# EAGLE design IDC-AMPSEAL (EAGLE 9.1.3)
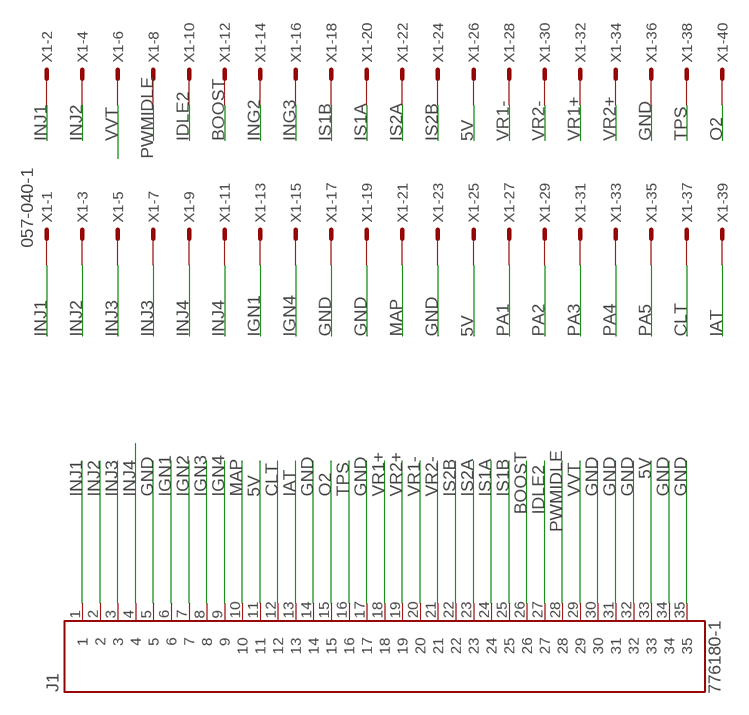
[diagram p0: schematic, sheet 1]

## Parts
J1  776180-1  [TE_776180-1]
X1  057-040-1  [057-040-1]

## Nets
5V: J1.11 J1.33 X1.25 X1.26
BOOST: J1.26 X1.12
CLT: J1.12 X1.37
GND: J1.5 J1.14 J1.17 J1.30 J1.31 J1.32 J1.34 J1.35 X1.17 X1.19 X1.23 X1.36
IAT: J1.13 X1.39
IDLE2: J1.27 X1.10
IGN1: J1.6 X1.13
IGN2: J1.7
IGN3: J1.8
IGN4: J1.9 X1.15
ING2: X1.14
ING3: X1.16
INJ1: J1.1 X1.1 X1.2
INJ2: J1.2 X1.3 X1.4
INJ3: J1.3 X1.5 X1.7
INJ4: J1.4 X1.9 X1.11
IS1A: J1.24 X1.20
IS1B: J1.25 X1.18
IS2A: J1.23 X1.22
IS2B: J1.22 X1.24
MAP: J1.10 X1.21
O2: J1.15 X1.40
PA1: X1.27
PA2: X1.29
PA3: X1.31
PA4: X1.33
PA5: X1.35
PWMIDLE: J1.28 X1.8
TPS: J1.16 X1.38
VR1+: J1.18 X1.32
VR1-: J1.20 X1.28
VR2+: J1.19 X1.34
VR2-: J1.21 X1.30
VVT: J1.29 X1.6

## Library data of the parts
J1 = 776180-1:776180-1: Conn Rectangular HDR 35 POS Solder RA Thru-Hole Automotive; MANUFACTURER: TE CONNECTIVITY; PARTREV: H7; STANDARD: STANDARED RECOMENDATION
X1 = con-panduit:057-040-: CONNECTOR 40-pin series 057 contact pc board low profile headers; OC_FARNELL: unknown; OC_NEWARK: unknown

## Board
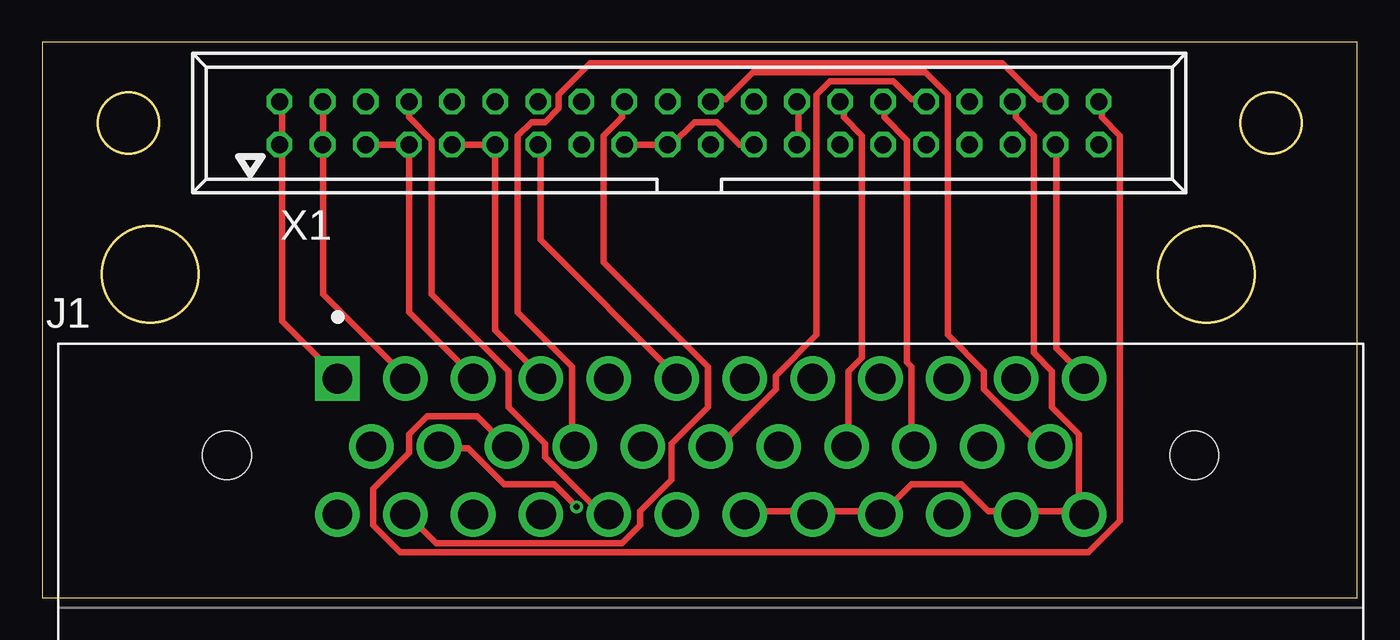
[diagram p1: board, top side]
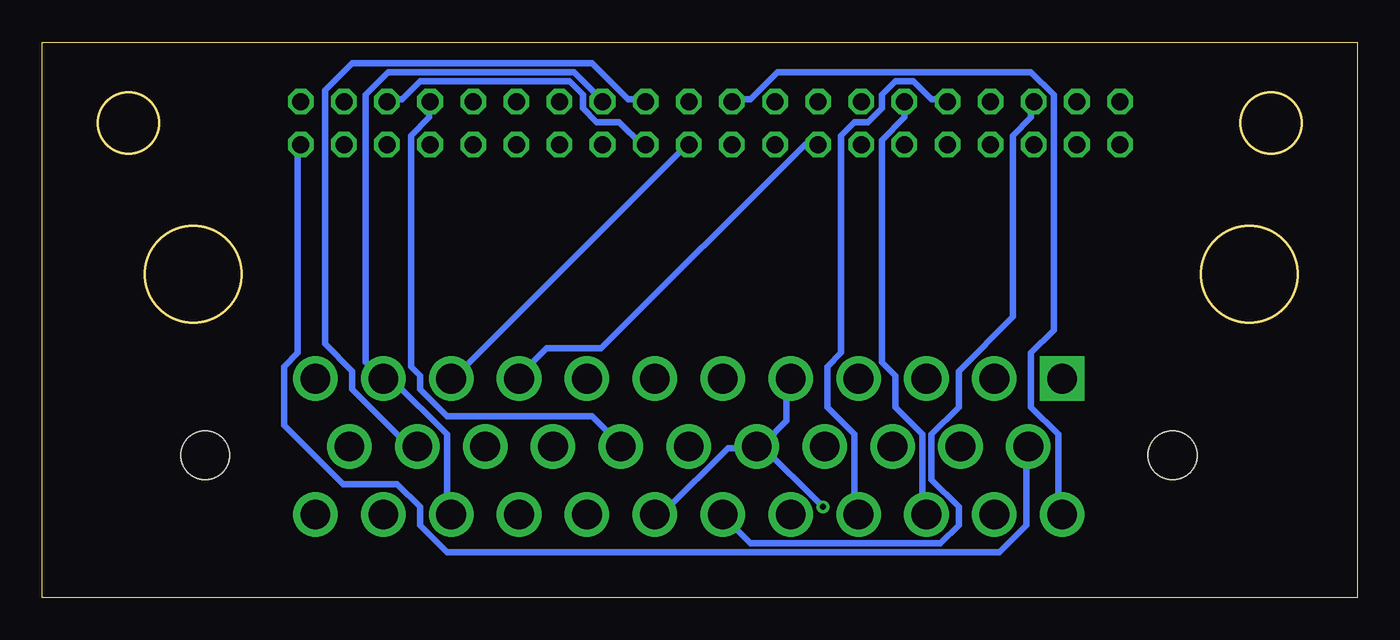
[diagram p2: board, bottom side, seen from below]

Size 77.45 x 32.69 mm. Coordinates in mm from the lower left corner, seen from the top.
Outline: 0,0 77.45,0 77.45,32.69 0,32.69 0,0
Outline: circle at 6.35,19.05 radius 2.84
Outline: circle at 68.58,19.05 radius 2.84
Outline: circle at 72.39,27.94 radius 1.8
Outline: circle at 5.08,27.94 radius 1.8
Copper layers (1*16): Top 0.035mm / dielectric 1.5mm / Bottom 0.035mm
Design rules "default *": minimum track width 15mil, minimum drill 0.35mm, track to track 6mil, track to pad 6mil, pad to pad 6mil, via to via 6mil, smd to smd 6mil, copper to edge 40mil, drill to drill 6mil, minimum pad ring 10mil, minimum via ring 8mil, stop-mask expansion 4mil, vias tented up to drill 0mil, thermal gap 10mil

### Footprints (pad centres in the part's own frame; a part is rotated, then mirrored left to right if it is on the bottom)
TE_776180-1 = drill 1.75 square: 1 -22,4 | drill 1.75: 2 -18,4; 3 -14,4; 4 -10,4; 5 -6,4; 6 -2,4; 7 2,4; 8 6,4; 9 10,4; 10 14,4; 11 18,4; 12 22,4; 13 -20,0; 14 -16,0; 15 -12,0; 16 -8,0; 17 -4,0; 18 0,0; 19 4,0; 20 8,0; 21 12,0; 22 16,0; 23 20,0; 24 -22,-4; 25 -18,-4; 26 -14,-4; 27 -10,-4; 28 -6,-4; 29 -2,-4; 30 2,-4; 31 6,-4; 32 10,-4; 33 14,-4; 34 18,-4; 35 22,-4 | hole 2.85: -28.5,-0.5; 28.5,-0.5
057-040-1 = drill 1 octagon: 1 -24.13,-1.27; 2 -24.13,1.27; 3 -21.59,-1.27; 4 -21.59,1.27; 5 -19.05,-1.27; 6 -19.05,1.27; 7 -16.51,-1.27; 8 -16.51,1.27; 9 -13.97,-1.27; 10 -13.97,1.27; 11 -11.43,-1.27; 12 -11.43,1.27; 13 -8.89,-1.27; 14 -8.89,1.27; 15 -6.35,-1.27; 16 -6.35,1.27; 17 -3.81,-1.27; 18 -3.81,1.27; 19 -1.27,-1.27; 20 -1.27,1.27; 21 1.27,-1.27; 22 1.27,1.27; 23 3.81,-1.27; 24 3.81,1.27; 25 6.35,-1.27; 26 6.35,1.27; 27 8.89,-1.27; 28 8.89,1.27; 29 11.43,-1.27; 30 11.43,1.27; 31 13.97,-1.27; 32 13.97,1.27; 33 16.51,-1.27; 34 16.51,1.27; 35 19.05,-1.27; 36 19.05,1.27; 37 21.59,-1.27; 38 21.59,1.27; 39 24.13,-1.27; 40 24.13,1.27

### Placement (x,y rotation side)
J1  39.37,8.89 0 top
X1  38.1,27.94 0 top

### Tracks (layer width: path | path; a pad name or v marks a point on that pad's centre or on a via)
5V
  Top 0.381: X1.25 44.54,26.67 44.54,29.07 X1.26
  Bottom 0.381: X1.26 44.54,29.34 46.14,30.94 57.07,30.94 58.41,29.6 58.41,13.87 57.61,13.07 J1.11 57.34,12.8 56.81,12.8 53.61,9.6 53.61,5.07 J1.33
BOOST
  Bottom 0.381: X1.12 26.67,28.27 28,26.94 28,13.87 27.2,13.07 27.2,11.2 25.6,9.6 25.6,5.07 J1.26
CLT
  Top 0.381: X1.37 59.74,26.67 59.74,14.67 61.34,13.07 J1.12
GND  (via drill 0.35)
  Top 0.381: X1.17 X1.19 37.07,26.67 38.41,28 39.74,28 41.07,26.67 X1.23 | v31.47,5.33 30.14,6.67 27.2,6.67 25.07,8.8 23.47,8.8 J1.14 | 61.07,5.07 61.34,5.07 J1.35 61.07,5.07 | 61.07,5.07 57.61,5.07 J1.34 57.34,5.07 55.74,5.07 54.14,6.67 51.21,6.67 49.61,5.07 J1.32 49.34,5.07 45.61,5.07 J1.31 45.34,5.07 41.6,5.07 J1.30 | 61.07,5.07 61.07,9.6 59.47,11.2 59.47,13.34 58.41,14.4 58.41,27.2 57.34,28.27 57.34,29.07 X1.36
  Bottom 0.381: X1.36 57.07,29.34 56.27,29.34 55.21,30.4 46.41,30.4 45.61,29.6 45.61,28.8 44.81,28 43.47,28 42.14,26.67 X1.23 | v31.47,5.33 35.2,9.07 J1.17 | J1.5 33.6,12.8 33.6,10.4 34.94,9.07 J1.17 | J1.17 35.47,8.8 37.07,8.8 40.8,5.07 41.34,5.07 J1.30
IAT
  Bottom 0.381: X1.39 62.41,26.67 62.41,14.4 63.21,13.6 63.21,10.13 59.74,6.67 56.54,6.67 55.21,5.33 55.21,4.27 53.61,2.67 21.07,2.67 19.47,4.27 19.47,8.8 J1.13
IDLE2
  Bottom 0.381: X1.10 24.27,29.34 25.07,29.34 26.14,30.4 27.2,30.4 28,29.6 28,28.8 28.8,28 29.6,28 30.4,27.2 30.4,14.4 31.2,13.6 31.2,11.2 29.6,9.6 29.6,5.07 J1.27
IGN1
  Top 0.381: X1.13 29.34,26.67 29.34,21.07 37.34,13.07 J1.6
IGN4
  Bottom 0.381: X1.15 32.54,26.67 44.54,14.67 47.74,14.67 49.34,13.07 J1.9
INJ1
  Top 0.381: 14.13,26.67 14.13,29.07 X1.2 | 14.13,26.67 14.13,16.27 17.34,13.07 J1.1 | 14.13,26.67 X1.1
INJ2
  Top 0.381: 16.54,26.67 16.54,29.07 X1.4 | 16.54,26.67 16.54,17.87 21.34,13.07 J1.2 | 16.54,26.67 X1.3
INJ3
  Top 0.381: X1.5 X1.7 21.6,26.67 21.6,16.8 25.34,13.07 J1.3
INJ4
  Top 0.381: X1.9 X1.11 26.67,15.73 29.34,13.07 J1.4
IS1A
  Bottom 0.381: X1.20 36.8,29.34 35.74,29.34 34.14,30.94 19.2,30.94 17.87,29.6 17.87,15.73 19.2,14.4 19.2,11.2 17.6,9.6 17.6,5.07 J1.24
IS1B
  Top 0.381: X1.18 34.14,29.07 34.14,28.27 33.07,27.2 33.07,19.74 39.2,13.6 39.2,11.2 37.07,9.07 37.07,6.93 35.2,5.07 35.2,4.27 34.14,3.2 23.2,3.2 21.6,4.8 J1.25
IS2A
  Top 0.381: X1.22 39.47,29.34 40.27,29.34 41.87,30.94 52.01,30.94 53.34,29.6 53.34,15.47 55.47,13.34 55.47,12.27 58.67,9.07 59.21,9.07 J1.23
IS2B
  Bottom 0.381: X1.24 42.14,29.34 42.94,29.34 45.07,31.47 59.21,31.47 60.81,29.87 60.81,14.94 59.21,13.34 59.21,12.27 56.01,9.07 55.47,9.07 J1.22
MAP
  Bottom 0.381: X1.21 39.47,26.67 53.34,12.8 J1.10
O2
  Top 0.381: X1.40 62.41,29.07 62.41,28.27 63.48,27.2 63.48,4.53 61.61,2.67 21.07,2.67 19.47,4.27 19.47,6.4 21.6,8.53 21.6,9.6 22.67,10.67 25.6,10.67 27.2,9.07 J1.15
PWMIDLE
  Top 0.381: X1.8 21.6,29.07 21.6,28.27 22.94,26.94 22.94,17.87 27.47,13.34 27.47,11.2 29.6,9.07 29.6,8.27 32.8,5.07 33.34,5.07 J1.28
TPS
  Top 0.381: X1.38 59.47,29.34 58.67,29.34 56.54,31.47 32.27,31.47 30.4,29.6 30.4,28.8 29.6,28 28.8,28 28,27.2 28,16.8 31.2,13.6 31.2,9.07 J1.16
VR1+
  Top 0.381: X1.32 52.01,29.34 51.21,29.34 50.14,30.4 46.41,30.4 45.61,29.6 45.61,15.47 43.2,13.07 43.2,12.27 40.01,9.07 39.47,9.07 J1.18
VR1-
  Top 0.381: X1.28 47.21,29.07 47.21,28.27 48.27,27.2 48.27,14.13 47.47,13.34 47.47,9.07 J1.20
VR2+
  Bottom 0.381: X1.34 54.67,29.07 54.67,28.27 55.74,27.2 55.74,13.6 55.21,13.07 55.21,12.27 53.61,10.67 45.07,10.67 43.47,9.07 J1.19
VR2-
  Top 0.381: X1.30 49.61,29.07 49.61,28.27 50.94,26.94 50.94,13.87 51.21,13.6 51.21,9.07 J1.21
VVT
  Bottom 0.381: X1.6 19.2,29.07 19.2,28.27 20.27,27.2 20.27,16.54 23.47,13.34 23.47,11.2 25.07,9.6 25.07,6.93 23.47,5.33 23.47,4.27 24.54,3.2 35.74,3.2 37.34,4.8 J1.29